# EAGLE schematic 60-amplifier-interlock (EAGLE 6.6.0)
AUTHOR: Andreas Weidner; COMPANY: Institute for Gravitational Research; DATE: 2013-03-20; DESCRIPTION: Differential output +-375V; FRMLATEXSYNTAX: 0; INFOSETTINGS: Used by 'plot.ulp' - do not edit manually! |FileTime=2015-03-18, 12:47:57|FileVersion=2||[LabelBox]|Company=Max-Planck-Institut für Gravitationsphysik|Title=HVAMPDIFF|Description=Differential output +-375V|Revision=2013-03-20|Date=2013-03-20|Author=Andreas Weidner|RevisionDate1=2015-02-04|RevisionAuthor1=Sean Leavey|RevisionDate2=2015-03-17|RevisionAuthor2=Sean Leavey|RevisionDate3=|RevisionAuthor3=|RevisionDate4=|RevisionAuthor4=|RevisionDate5=|RevisionAuthor5=||[FrontMatter]|DocTitle=Differential output HV amplifier|SubTitle=Circuit Board Documentation|Authors=Andreas Weidner and Sean Leavey|Keywords=|Abstract={This circuit provides a high-voltage amplifier with the following features:\n\\begin{compactitem}[\\enspace\\textbullet]\n\\item One output with positive gain, the other with negative gain,\n resulting in a differential output voltage of up to 750\\,V\n\\item Full-power bandwidth 400\\,kHz standard, higher with careful component trimming and peaking\n\\item Differential inputs with gain of 20 (single-sided output, differential\n output gain 40) and a selectable impedance of either >\\,1\\,k$\\Omega$\n or 50\\,$\\Omega$\n\\item Soft start of high-voltage sink to prevent power supply from locking during start-up\n\\item Over-temperature protection of output amplifier heatsink\n\\item Over-pressure protection using external pressure signal\n\\end{compactitem}}|LaTeXSyntax=1||[Safety]|VoltageHazard=1|HeatHazard=1|Convection=1|ForcedAir=0|WaterCooling=0|LightHazard=0|LaserPower=1000|LaserWavelength=1064|LaserClass=6|LightPower=1000|LightInvisible=0||[Notes]|Machinery=0|IntendedUsers=0|DisplayHints=1|; PLOTSETTINGS: Used by 'plot.ulp' - do not edit manually! |FileTime=2015-03-18, 12:47:57|FileVersion=2||[Board]|CreateBoard=0|PadDisplay=0|CreateDrillPlan=1|SiebMeyerFormat=0|IsiDrillFormat=1|CreateSolderStop=1|CreateCreamMask=0|CreateLegend=1|DisplayDimension=0|DisplayReference=1|CompensateSkew=1||[Documentation]|CreateDocumentation=1|CreateSheetDocs=1|DisplayNames=1|DisplayValues=1|DisplaySimulate=0|CreatePartList=1|CreateBoardDocs=1|CreatePlaceplan=1|DisplayJumper=1|CreateWiring=0|DisplayVias=1|CreateDrillMap=1|Create800uMap=0|CreatePreview=0|CreateValueList=1|CreateNetList=0|CreateLaTeX=1||[Variants]|HighlightUndefines=0|HighlightVariants=1|ShowVariantLists=1||[BoardSetup]|ProcessPolygons=0|PageSize=0|PageOrientation=0|MarginLeft=5|MarginTop=5|MarginRight=5|MarginBottom=5|DrillRackMM=0||[DocumentationSetup]|BlackWhite=0|FigureWidth=168|FigureHeight=237|ShrinkFigure=1|ExpandFigure=0|FigureRotate=1|TextWidth=72|ValueLibrary=1|PalatinoFont=1|LuximonoFont=1|IgnoreWidth=1||[MiscSetup]|OutlinePrecision=0.5|OutlineDiameter=2|; REVISION: 2013-03-20; REVISIONAUTHOR1: Sean Leavey; REVISIONAUTHOR2: Sean Leavey; REVISIONDATE1: 2015-02-04; REVISIONDATE2: 2015-03-17; TITLE: ERC SPEEDMETER; TITLE2: DIFF HV AMP; VARIANTSETTINGS: Used by 'variants.ulp' - do not edit manually! |FileTime=2013-05-23, 16:49:02|FileVersion=1||Title0=0-400V|Description0=|

## Sheet 1 of 3
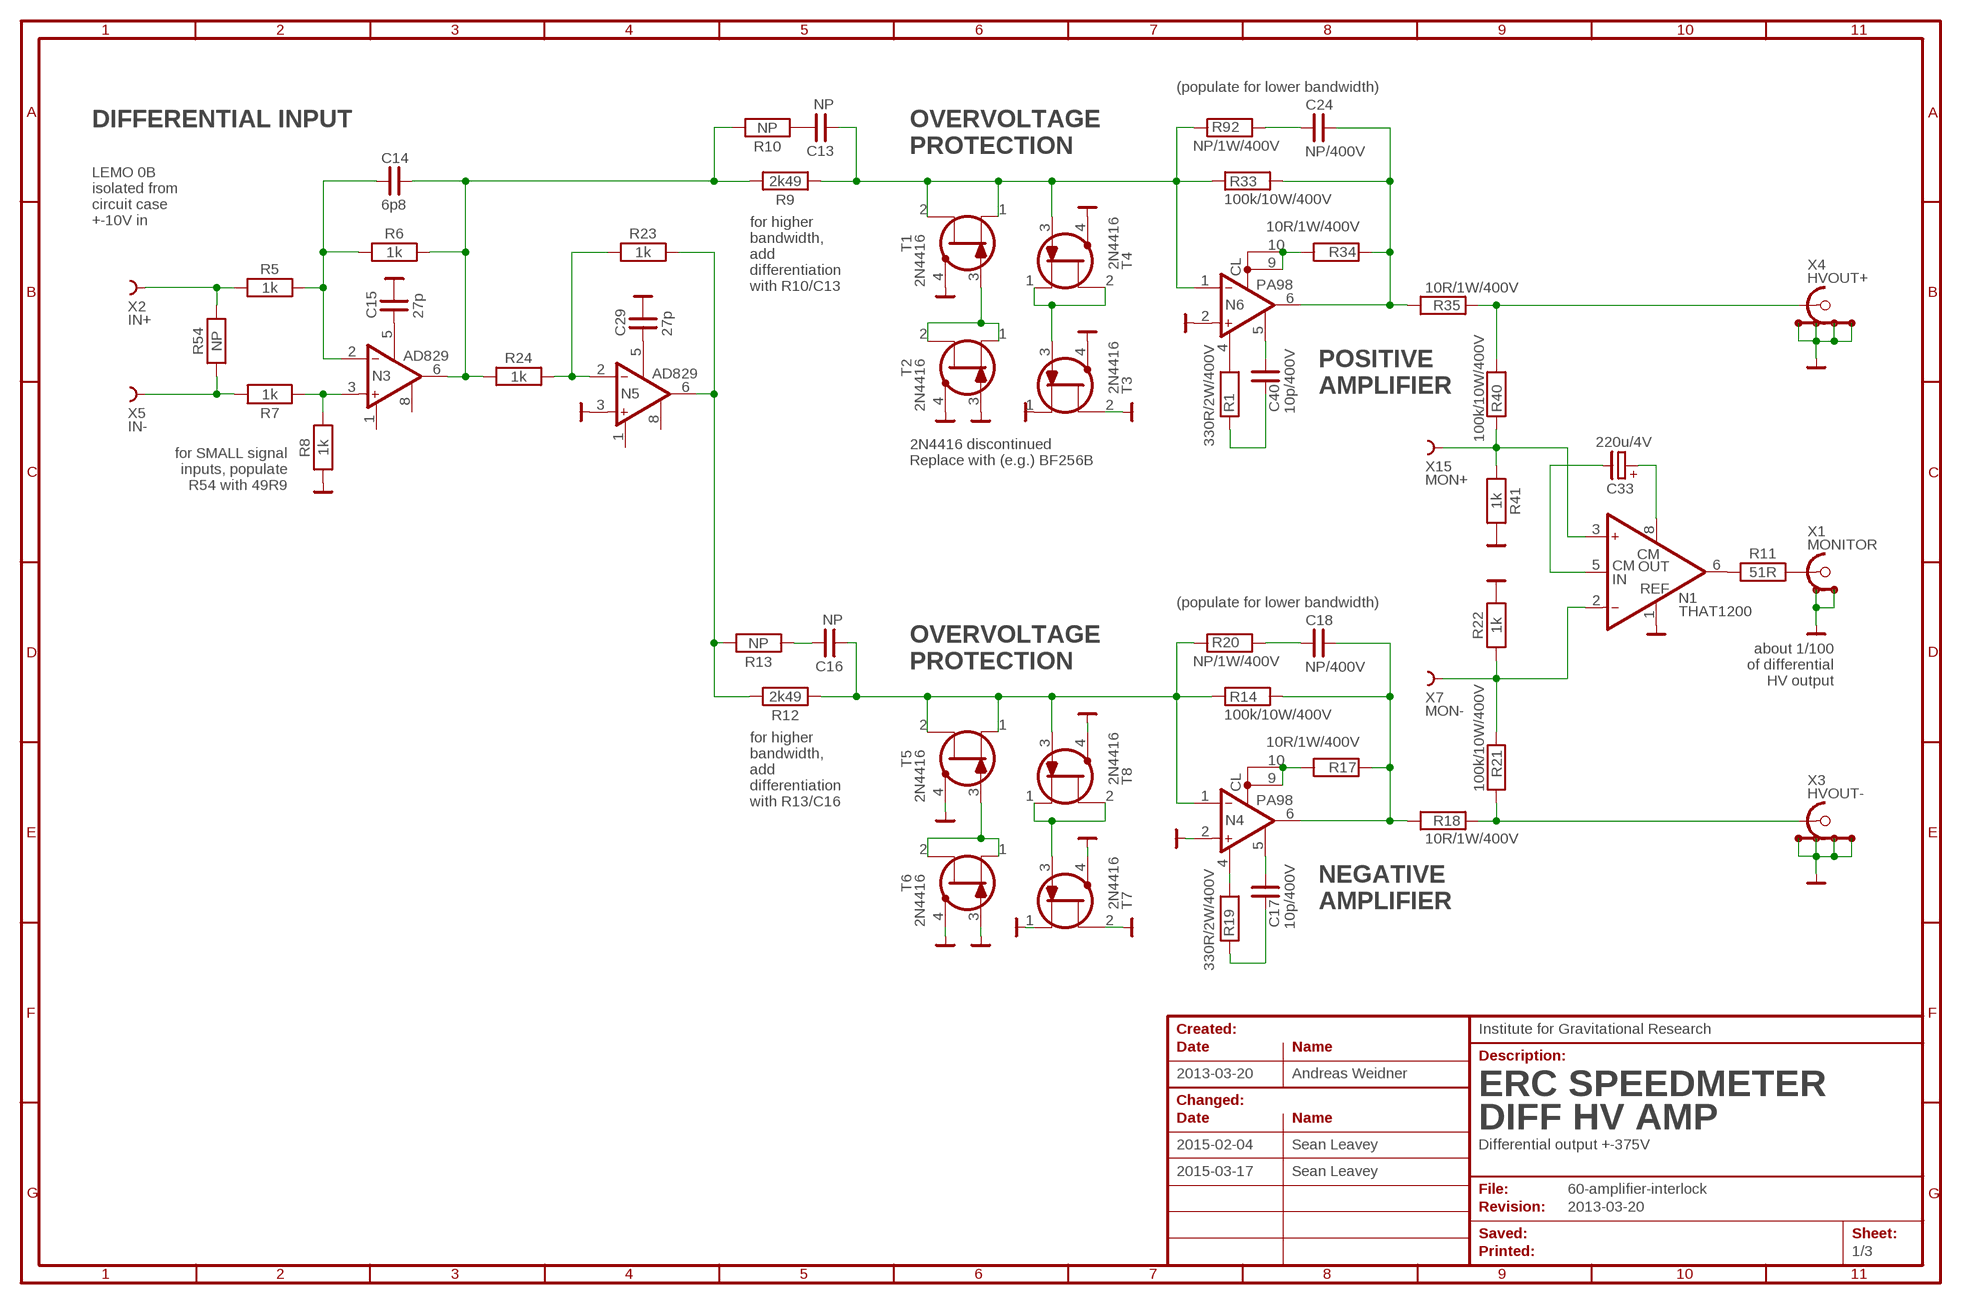
[diagram p0: schematic, sheet 1]
$47 (FRAME-A4-LANDSCAPE): SPICE: <ignore>

### Parts
C13  NP  C01N  [C01N]
C14  6p8  C0805  [C0805]
C15  27p  C0805  [C0805]
C16  NP  C01N  [C01N]
C17  10p/400V  C03R  [C03R]
C18  NP/400V  C03R  [C03R]
C24  NP/400V  C03R  [C03R]
C29  27p  C0805  [C0805]
C33  220u/4V  CEC  [CEC]
C40  10p/400V  C03R  [C03R]
N1  THAT1200  [DIP08L]
N3  AD829  [DIP08L]
N4  PA98V  [SIP03V]
N5  AD829  [DIP08L]
N6  PA98V  [SIP03V]
R1  330R/2W/400V  R04R  [R04R]
R5  1k  R1206  [R1206]
R6  1k  R1206  [R1206]
R7  1k  R1206  [R1206]
R8  1k  R1206  [R1206]
R9  2k49  R04R  [R04R]
R10  NP  R04  [R04N]
R11  51R  R1206  [R1206]
R12  2k49  R04R  [R04R]
R13  NP  R04  [R04N]
R14  100k/10W/400V  R02A  [TO220-2A]
R17  10R/1W/400V  R04R  [R04R]
R18  10R/1W/400V  R04N  [R04N]
R19  330R/2W/400V  R04R  [R04R]
R20  NP/1W/400V  R04R  [R04R]
R21  100k/10W/400V  R02A  [TO220-2A]
R22  1k  R1206  [R1206]
R23  1k  R1206  [R1206]
R24  1k  R1206  [R1206]
R33  100k/10W/400V  R02A  [TO220-2A]
R34  10R/1W/400V  R04R  [R04R]
R35  10R/1W/400V  R04N  [R04N]
R40  100k/10W/400V  R02A  [TO220-2A]
R41  1k  R1206  [R1206]
R54  NP  R1206  [R1206]
R92  NP/1W/400V  R04R  [R04R]
T1  2N4416  [TO72N]
T2  2N4416  [TO72N]
T3  2N4416  [TO72N]
T4  2N4416  [TO72N]
T5  2N4416  [TO72N]
T6  2N4416  [TO72N]
T7  2N4416  [TO72N]
T8  2N4416  [TO72N]
X1  MONITOR  XS01-2S-RG174  [XS01-2S-RG174]
X2  IN+  XP-0.8CERAM-N  [XT-0.8CERAM-N]
X3  HVOUT-  XS01-4S-RG58  [XS01-4S-RG58]
X4  HVOUT+  XS01-4S-RG58  [XS01-4S-RG58]
X5  IN-  XP-0.8CERAM-N  [XT-0.8CERAM-N]
X7  MON-  XP-0.8CERAM-N  [XT-0.8CERAM-N]
X15  MON+  XP-0.8CERAM-N  [XT-0.8CERAM-N]

### Nets
GND: C15.2 C29.2 N1.1(A:REF) N4.2(A:IN+) N5.3(A:IN+) N6.2(A:IN+) R8.1 R22.2 R41.2 T1.4(CASE) T2.3(G) T2.4(CASE) T3.1(S) T3.2(D) T3.4(CASE) T4.4(CASE) T5.4(CASE) T6.3(G) T6.4(CASE) T7.1(S) T7.2(D) T7.4(CASE) T8.4(CASE) X1.GND@1(GND) X1.GND@2(GND) X3.GND@1(GND) X3.GND@2(GND) X3.GND@3(GND) X3.GND@4(GND) X4.GND@1(GND) X4.GND@2(GND) X4.GND@3(GND) X4.GND@4(GND) ; supply symbol labelled VG ; also sheet 2,3
HVOUT+ [HV]: R35.2 R40.1 X4.SIG
HVOUT- [HV]: R18.2 R21.1 X3.SIG
MON+: N1.3(A:IN+) R40.2 R41.1 X15.MP
MON-: N1.2(A:IN-) R21.2 R22.1 X7.MP
N$3: R11.2 X1.SIG
N$6: N1.6(A:OUT) R11.1
N$9: C16.2 R13.1
N$11: T7.3(G) T8.1(S) T8.2(D)
N$13: T5.3(G) T6.1(S) T6.2(D)
N$14 [HV]: N4.9(A:CL) N4.10(A:CL) R17.1
N$15: R5.1 R54.2 X2.MP
N$16: R7.1 R54.1 X5.MP
N$17: C14.1 N3.2(A:IN-) R5.2 R6.1
N$18: C15.1 N3.5(A:OPF)
N$19: C14.2 N3.6(A:OUT) R6.2 R9.2 R10.2 R24.1
N$20: N3.3(A:IN+) R7.2 R8.2
N$21 [HV]: C18.2 N4.6(A:OUT) R14.1 R17.2 R18.1
N$23 [HV]: N4.4(A:OPC1) R19.2
N$24 [HV]: C17.1 N4.5(A:OPC2)
N$25 [HV]: C17.2 R19.1
N$26: C16.1 N4.1(A:IN-) R12.1 R14.2 R20.1 T5.1(S) T5.2(D) T8.3(G)
N$27 [HV]: C18.1 R20.2
N$29: C29.1 N5.5(A:OPF)
N$30: N5.2(A:IN-) R23.1 R24.2
N$31: N5.6(A:OUT) R12.2 R13.2 R23.2
N$32: C33.+ N1.8(A:CMOUT)
N$33: C33.- N1.5(A:CMIN)
N$39: C13.2 R10.1
N$49 [HV]: N6.9(A:CL) N6.10(A:CL) R34.1
N$52 [HV]: C24.2 N6.6(A:OUT) R33.1 R34.2 R35.1
N$60: T3.3(G) T4.1(S) T4.2(D)
N$61: T1.3(G) T2.1(S) T2.2(D)
N$68 [HV]: N6.4(A:OPC1) R1.2
N$69 [HV]: C40.1 N6.5(A:OPC2)
N$70 [HV]: C40.2 R1.1
N$71: C13.1 N6.1(A:IN-) R9.1 R33.2 R92.1 T1.1(S) T1.2(D) T4.3(G)
N$146 [HV]: C24.1 R92.2
Unconnected: N3.1(A:OPC1) N3.8(A:OPC2) N5.1(A:OPC1) N5.8(A:OPC2)

### Notes on the sheet
- (populate for lower bandwidth)
- DIFFERENTIAL INPUT | OVERVOLTAGE
- PROTECTION
- for higher
  bandwidth,
  add
  differentiation
  with R10/C13
- LEMO 0B
  isolated from
  circuit case
  +-10V in
- POSITIVE
  AMPLIFIER
- for SMALL signal
  inputs, populate
  R54 with 49R9
- 2N4416 discontinued
  Replace with (e.g.) BF256B
- (populate for lower bandwidth)
- OVERVOLTAGE
- about 1/100
  of differential
  HV output
- PROTECTION
- for higher
  bandwidth,
  add
  differentiation
  with R13/C16
- NEGATIVE
  AMPLIFIER

## Sheet 2 of 3
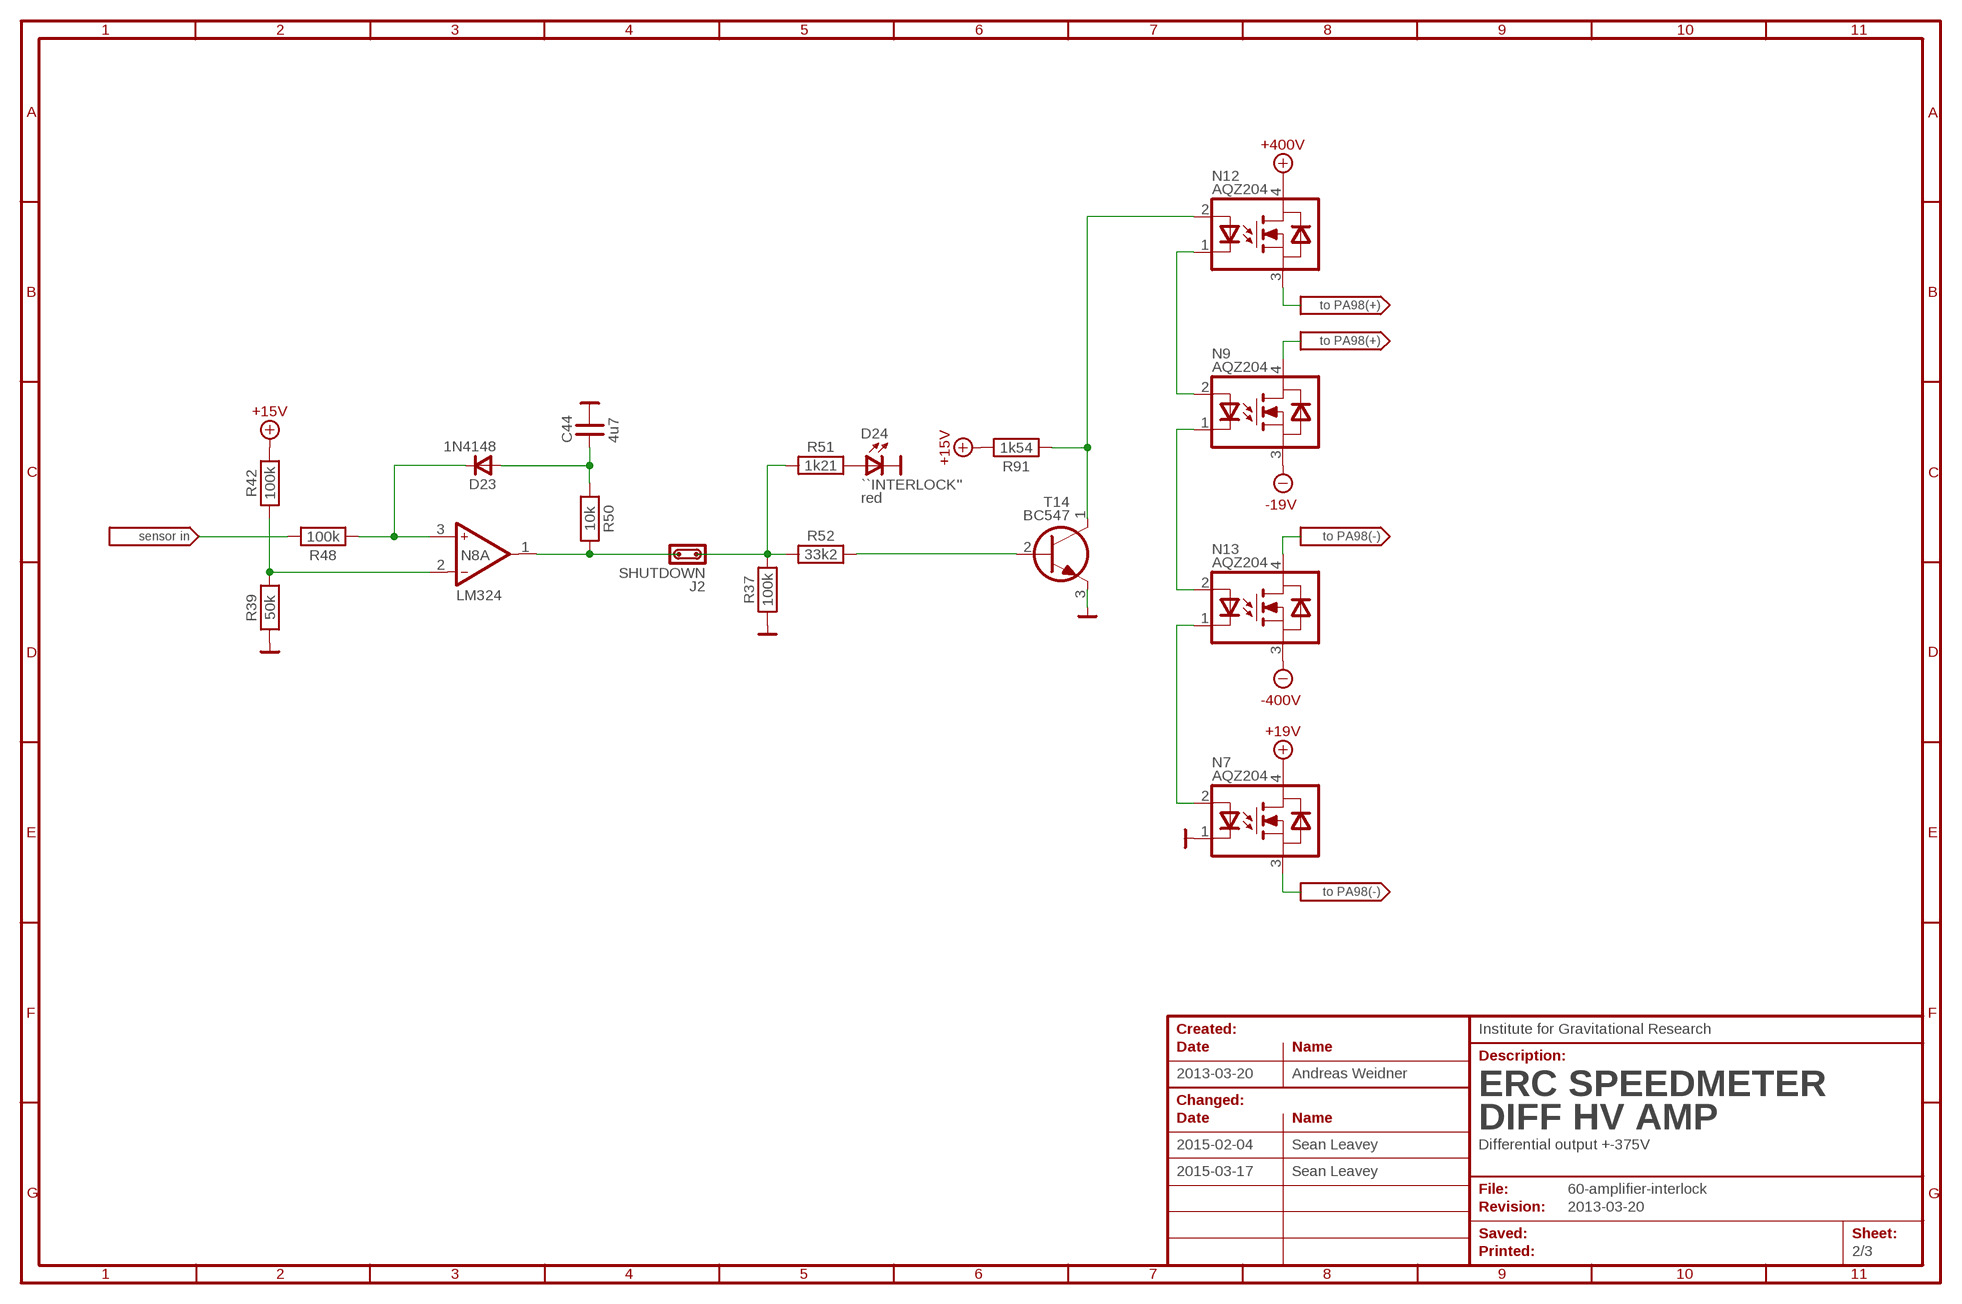
[diagram p1: schematic, sheet 2]
$6 (VS): SPICE: <ignore>
$14 (VS): SPICE: <ignore>
$15 (VS): SPICE: <ignore>
$45 (FRAME-A4-LANDSCAPE): SPICE: <ignore>
$83 (VS): SPICE: <ignore>
$84 (VS): SPICE: <ignore>

### Parts
C44  4u7  C02-MKS2-7.0-R  [C02-MKS2-7.0-R]
D23  1N4148  1N4148-04R  [D04R-DO35-TYPE]
D24  ``INTERLOCK''  DL-CABLE-CODED-L  [DL-CABLE-CODED-L]
J2  SHUTDOWN  JP02R  [JP02R]
N7  AQZ204  AQZ104R  [AQZ-R]
N8  LM324  [DIP14L]
N9  AQZ204  AQZ104R  [AQZ-R]
N12  AQZ204  AQZ104R  [AQZ-R]
N13  AQZ204  AQZ104R  [AQZ-R]
R37  100k  R04R  [R04R]
R39  50k  R  [R04N]
R42  100k  R  [R04N]
R48  100k  R  [R04N]
R50  10k  R  [R04N]
R51  1k21  R04R  [R04R]
R52  33k2  R04R  [R04R]
R91  1k54  R04R  [R04R]
T14  BC547DR  [TO92DR]

### Nets
+15V: R42.2 R91.2 ; supply symbol labelled V+15V ; also sheet 3
+19V: N7.4(+) ; supply symbol labelled V+19V ; also sheet 3
+400V [HV]: N12.4(+) ; supply symbol labelled V+400V ; also sheet 3
-19V: N9.3(-) ; supply symbol labelled V-19V ; also sheet 3
-400V [HV]: N13.3(-) ; supply symbol labelled V-400V ; also sheet 3
GND: C44.2 D24.C N7.1(C) R37.1 R39.1 T14.3(E) ; supply symbol labelled VG ; also sheet 1,3
N$1: N7.3(-)
N$4: N9.4(+)
N$41: R48.2
N$43: N9.2(A) N12.1(C)
N$45: N7.2(A) N13.1(C)
N$46: C44.1 D23.A R50.1
N$50: N8.2(A:IN-) R39.2 R42.1
N$51: J2.1 R37.2 R51.1 R52.1
N$53: J2.2 N8.1(A:OUT) R50.2
N$54: D24.A R51.2
N$55: R52.2 T14.2(B)
N$57: D23.C N8.3(A:IN+) R48.1
N$59: N12.2(A) R91.1 T14.1(C)
N$96 [HV]: N13.4(+)
N$125 [HV]: N12.3(-)
N$127: N9.1(C) N13.2(A)
Unconnected: N8.5(B:IN+) N8.6(B:IN-) N8.7(B:OUT) N8.8(C:OUT) N8.9(C:IN-) N8.10(C:IN+) N8.12(D:IN+) N8.13(D:IN-) N8.14(D:OUT)

## Sheet 3 of 3
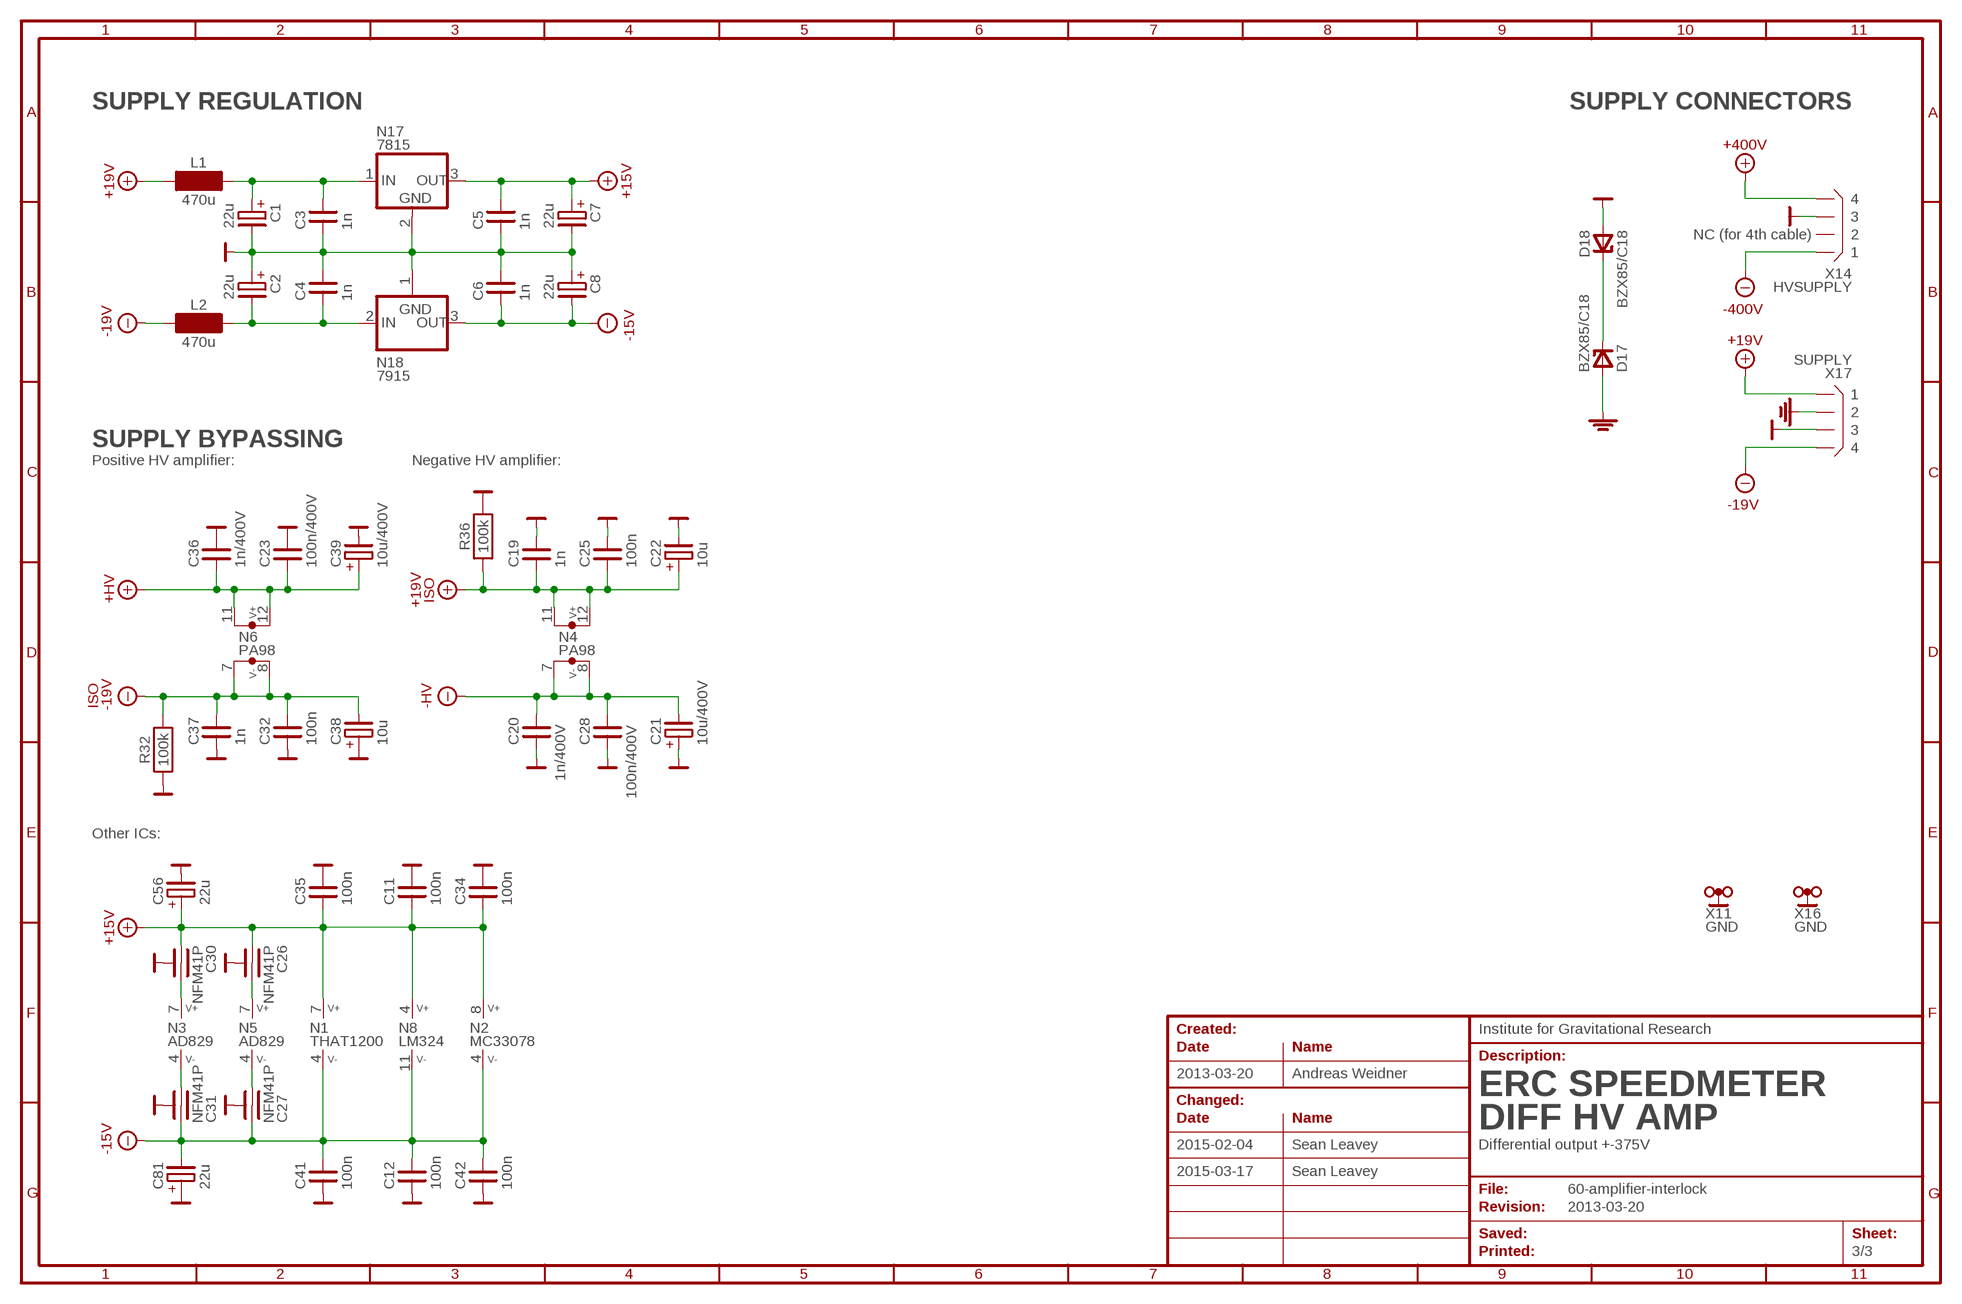
[diagram p2: schematic, sheet 3]
$46 (FRAME-A4-LANDSCAPE): SPICE: <ignore>

### Parts
C1  22u  CE02-TANTAL-7.5-N  [CE02-TANTAL-7.5-N]
C2  22u  CE02-TANTAL-7.5-N  [CE02-TANTAL-7.5-N]
C3  1n  C01N  [C01N]
C4  1n  C01N  [C01N]
C5  1n  C01N  [C01N]
C6  1n  C01N  [C01N]
C7  22u  CE02-TANTAL-7.5-N  [CE02-TANTAL-7.5-N]
C8  22u  CE02-TANTAL-7.5-N  [CE02-TANTAL-7.5-N]
C11  100n  C01R  [C01R]
C12  100n  C01R  [C01R]
C19  1n  C0805  [C0805]
C20  1n/400V  C1206  [C1206]
C21  10u/400V  CE02A  [CE02A]
C22  10u  CE01-TANTAL-5.0-N  [CE01-TANTAL-5.0-N]
C23  100n/400V  C1812  [C1812]
C25  100n  C0805  [C0805]
C26  NFM41P  CF  [CF-NFM41P]
C27  NFM41P  CF  [CF-NFM41P]
C28  100n/400V  C1812  [C1812]
C30  NFM41P  CF  [CF-NFM41P]
C31  NFM41P  CF  [CF-NFM41P]
C32  100n  C0805  [C0805]
C34  100n  C01R  [C01R]
C35  100n  C01-CERAMIC-R  [C01-CERAMIC-R]
C36  1n/400V  C1206  [C1206]
C37  1n  C0805  [C0805]
C38  10u  CE01-TANTAL-5.0-N  [CE01-TANTAL-5.0-N]
C39  10u/400V  CE02A  [CE02A]
C41  100n  C01-CERAMIC-R  [C01-CERAMIC-R]
C42  100n  C01R  [C01R]
C56  22u  CE02-TANTAL-7.5-N  [CE02-TANTAL-7.5-N]
C81  22u  CE02-TANTAL-7.5-N  [CE02-TANTAL-7.5-N]
D17  BZX85/C18  DZ04B  [DZ04B]
D18  BZX85/C18  DZ04B  [DZ04B]
L1  470u  LA  [LA]
L2  470u  LA  [LA]
N2  MC33078  [DIP08L]
N17  7815  [TO220N]
N18  7915  [TO220N]
R32  100k  R  [R04N]
R36  100k  R  [R04N]
X11  XG  [XG02N]
X14  HVSUPPLY  X04-SCREW  [X04-SCREW]
X16  XG  [XG02N]
X17  SUPPLY  X04-SCREW  [X04-SCREW]

### Nets
+15V: C5.2 C7.+ C11.1 C26.1 C30.1 C34.1 C35.1 C56.+ N1.7(P:V+) N2.8(P:V+) N8.4(P:V+) N17.3(OUT) ; supply symbol labelled V+15V ; also sheet 2
+19V: L1.1 X17.1 ; supply symbol labelled V+19V ; also sheet 2
+19VISO: C19.1 C22.+ C25.1 N4.11(P:V+) N4.12(P:V+) R36.1 ; supply symbol labelled V+19V-ISO
+400V [HV]: X14.4 ; supply symbol labelled V+400V ; also sheet 2
+HV [HV]: C23.1 C36.1 C39.+ N6.11(P:V+) N6.12(P:V+) ; supply symbol labelled V+HV
-15V: C6.1 C8.- C12.2 C27.1 C31.1 C41.2 C42.2 C81.- N1.4(P:V-) N2.4(P:V-) N8.11(P:V-) N18.3(OUT) ; supply symbol labelled V-15V
-19V: L2.1 X17.4 ; supply symbol labelled V-19V ; also sheet 2
-19VISO: C32.2 C37.2 C38.- N6.7(P:V-) N6.8(P:V-) R32.2 ; supply symbol labelled V-19V-ISO
-400V [HV]: X14.1 ; supply symbol labelled V-400V ; also sheet 2
-HV [HV]: C20.2 C21.- C28.2 N4.7(P:V-) N4.8(P:V-) ; supply symbol labelled V-HV
GND: C1.- C2.+ C3.1 C4.2 C5.1 C6.2 C7.- C8.+ C11.2 C12.1 C19.2 C20.1 C21.+ C22.- C23.2 C25.2 C26.GND C27.GND C28.1 C30.GND C31.GND C32.1 C34.2 C35.2 C36.2 C37.1 C38.+ C39.- C41.1 C42.1 C56.- C81.+ D18.A N17.2(GND) N18.1(GND) R32.1 R36.2 X14.3 X17.3 ; supply symbol labelled VG ; also sheet 1,2
N$2: C1.+ C3.2 L1.2 N17.1(IN)
N$5: C2.- C4.1 L2.2 N18.2(IN)
N$7: C27.2 N5.4(P:V-)
N$28: C26.2 N5.7(P:V+)
N$80: C31.2 N3.4(P:V-)
N$81: C30.2 N3.7(P:V+)
N$93: D17.C D18.C
PE: D17.A X17.2 ; supply symbol labelled VPE
Unconnected: N2.1(A:OUT) N2.2(A:IN-) N2.3(A:IN+) N2.5(B:IN+) N2.6(B:IN-) N2.7(B:OUT) X14.2

### Notes on the sheet
- SUPPLY REGULATION | SUPPLY CONNECTORS
- NC (for 4th cable)
- SUPPLY BYPASSING
- Positive HV amplifier: | Negative HV amplifier:
- Other ICs:

## Power pins joined to a net without a drawn wire
GND: X11.MP1(GND) X11.MP2(GND) X16.MP1(GND) X16.MP2(GND)

## Library data of the parts
C1 C2 C7 C8 C21 C22 C33 C38 C39 C56 C81 = miscs:CE: Electrolytic capacitor, unipolar _____ SPICE implementation as a bipolar capacitor with the supported attributes: VALUE, VOLTAGE, CPARALLEL, LSERIES, RLSHUNT, RPARALLEL, RSERIES (A detailed description of these parameters can be found in the library spice.lbr); SPICE: <IDEALMODEL>\n<name:C> <pin:A.+> <pin:A.-> <autovalue><voltage: ic=>\n\n<REALMODEL>\n<name:C> <pin:A.+> <pin:A.-> <autovalue><voltage: ic=><rseries: rser=><lseries: lser=><rparallel: rpar=><cparallel: cpar=><rlshunt: rlshunt=>
C3-C6 C11-C20 C23-C25 C28 C29 C32 C34-C37 C40-C42 C44 = miscs:C: Capacitor, bipolar _____ Supported SPICE attributes: VALUE, VOLTAGE, CPARALLEL, LSERIES, RLSHUNT, RPARALLEL, RSERIES (A detailed description of these parameters can be found in the library spice.lbr) _____ References (PDF files, electronics workshop server): WIMA FKP 02 <http://elektronik.aei.uni-hannover.de:3000/datasheets/capacitors/wima-fkp02.pdf> (polypropylene film capacitors, 0.1" spacing) WIMA FKP 2 <http://elektronik.aei.uni-hannover.de:3000/datasheets/capacitors/wima-fkp2.pdf> (polypropylene film capacitors, 0.2" spacing) WIMA FKS 2 <http://elektronik.aei.uni-hannover.de:3000/datasheets/capacitors/wima-fks2.pdf> (polyester film capacitors, 0.2" spacing) WIMA MKP 2 <http://elektronik.aei.uni-hannover.de:3000/datasheets/capacitors/wima-mkp2.pdf> (polypropylene film capacitors, 0.2" spacing) WIMA MKS 02 <http://elektronik.aei.uni-hannover.de:3000/datasheets/capacitors/wima-mks02.pdf> (polyester film capacitors, 0.1" spacing) WIMA MKS 2 <http://elektronik.aei.uni-hannover.de:3000/datasheets/capacitors/wima-mks2.pdf> (polyester film capacitors, 0.2" spacing) Kemet ceramics <http://elektronik.aei.uni-hannover.de:3000/datasheets/capacitors/kemet-ceramics.pdf> (multilayer ceramic leaded capacitors) Vishay ceramics HV <http://elektronik.aei.uni-hannover.de:3000/datasheets/capacitors/vishay-ceramic-hv.pdf> (multilayer ceramic leaded capacitors, high voltage) LCR EXFS/HR polystyrene <http://elektronik.aei.uni-hannover.de:3000/datasheets/capacitors/exfshr-polystyrene.pdf> (polystyrene radial capacitors, 0.2" spacing) LCR FSC polystyrene <http://elektronik.aei.uni-hannover.de:3000/datasheets/capacitors/fsc-polystyrene.pdf> (polystyrene axial capacitors, round); SPICE: <IDEALMODEL>\n<name:C> <pin:A.1> <pin:A.2> <autovalue><voltage: ic=>\n\n<REALMODEL>\n<name:C> <pin:A.1> <pin:A.2> <autovalue><voltage: ic=><rseries: rser=><lseries: lser=><rparallel: rpar=><cparallel: cpar=><rlshunt: rlshunt=>
C26 C27 C30 C31 = miscs:CF: Feedthrough capacitor bipolar _____ SPICE implementation as a bipolar capacitor in the center of two 50µΩ resistors, supporting the attributes: VALUE, VOLTAGE (A detailed description of these parameters can be found in the library spice.lbr); SPICE: <name:R>.left <pin:A.1> <name>.C 50u\n<name:R>.right <name>.C <pin:A.2> 50u\n<name:C> <name>.C <pin:A.GND> <autovalue><voltage: ic=>
D17 D18 = diodes:DZ: Zener diode; VALUE: DZ
D23 = diodes:1N4148: 1N4148/LL4148/1N4448/LL4448: General purpose silicon diode 100V, 200mA, 500mW, 1V @ 10mA Wired packages: 1N4148/1N4448, MiniMELF package: LL4148/LL4448 _____ Supported SPICE subcircuits: 1N4148-SUB Supported SPICE attributes: TEMPERATURE; SPICE: <name:X> <pin:A.A> <pin:A.C> <subckt:1N4148-SUB><temperature: devicetemp=>; TYPE: 1N4148
D24 = optos:DL: LED _____ The LED colour can be changed with the attribute COLOR.; COLOR: red; IGNOREVALUE: 1
J2 = connectors:JP02: Jumper 2 pins; IGNOREVALUE: 1; SPICE: <ignore>
L1 L2 = miscs:L: Coil, European symbol _____ Supported SPICE attributes: VALUE, CURRENT, CPARALLEL, RPARALLEL, RSERIES (A detailed description of these parameters can be found in the library spice.lbr)
N1 = opamps:THAT1200: THAT1200: Balanced line receiver (THAT corporation) Gain=1, ±15V, ±25mA, 1.4nA bias 300nA offset current, 12MHz UGF, 27nV/rt(Hz) noise _____ References: - PDF datasheet <http://elektronik.aei.uni-hannover.de:3000/datasheets/opamps/instrumentation/that1200.pdf> (electronics workshop server) - Manufacturer's link <http://www.thatcorp.com/1200-series_High_CMRR_Balanced_Line_Receiver_ICs.shtml#appnotes> (THAT Corporation website) - Internet search <http://www.google.de/search?q=that1200> (Google results) ___ Supported SPICE subcircuits: 1200_THAT; SPICE: <gate:A>\n <part:X> <pin:A.IN+> <pin:A.IN-> <pin:P.V+> <pin:P.V-> <pin:A.OUT> <pin:A.REF> <pin:A.CMIN> <pin:A.CMOUT> <subckt:1200_THAT>\n<gate:P>\n <ignore>; TYPE: THAT1200
N2 = opamps:MC33078: MC33078: Dual low noise opamp (ST Microelectronics) ±15V, ±15mA, 750nA bias 2mV offset, 10MHz UGF, 4.5nV/rt(Hz) noise _____ References: - PDF datasheet <http://elektronik.aei.uni-hannover.de:3000/datasheets/opamps/opamps/mc33078.pdf> (electronics workshop server) - Manufacturer's link <http://www.st.com/web/catalog/sense_power/FM123/SC61/SS1614/PF64026?s_searchtype=partnumber> (ST Microelectronics website) - Internet search <http://www.google.de/search?q=mc33078> (Google results); TYPE: MC33078
N3 N5 = opamps:AD829: AD829: High speed video opamp (Analog Devices) ±15V, ±32mA, 9µA bias 1mV offset, 600MHz UGF, 2nV/rt(Hz) noise _____ References: - PDF datasheet <http://elektronik.aei.uni-hannover.de:3000/datasheets/opamps/opamps/ad829.pdf> (electronics workshop server) - Manufacturer's link <http://www.analog.com/en/all-operational-amplifiers-op-amps/operational-amplifiers-op-amps/ad829/products/product.html> (Analog Devices website) - Internet search <http://www.google.de/search?q=ad829> (Google results) _____ Supported SPICE subcircuit: AD829 Supported LISO model: AD829; LISO: <gate:A>\n op <part> <type> <pin:A.IN+> <pin:A.IN-> <pin:A.OUT>\n <warning:Compensation and power supply of <part> not included in simulation>\n\n<gate:P>\n <ignore>; SPICE: <gate:A>\n <name:X> <pin:A.IN+> <pin:A.IN-> <pin:P.V+> <pin:P.V-> <pin:A.OUT> <pin:A.OPF> <subckt:AD829>\n\n<gate:P>\n <ignore>; TYPE: AD829
N4 N6 = opamps:PA98: PA98: High voltage power opamp (Apex) ±225V, ±200mA, 100pA bias 2mV offset, 100MHz UGF, 4nV/rt(Hz) noise _____ References: - PDF datasheet <http://elektronik.aei.uni-hannover.de:3000/datasheets/opamps/opamps/pa98.pdf> (electronics workshop server) - Manufacturer's link <http://www.cirrus.com/en/products/pa98.html?prodKey=pa98> (Cirrus Logic website) - Internet search <http://www.google.de/search?q=pa98> (Google results) _____ Supported SPICE subcircuit: PA98; SPICE: <gate:A>\n <name:X> <pin:A.IN+> <pin:A.IN-> <pin:A.CL@1> <pin:A.OUT> <pin:P.V+@1> <pin:P.V-@1> <pin:A.OPC1> <pin:A.OPC2> <subckt:PA98>\n\n<gate:P>\n <ignore>; TYPE: PA98; VALUE: PA98
N7 N9 N12 N13 = optos:AQZ10*
N8 = opamps:LM324: LM324: Quad opamp (National Semiconductor) ±15V, ±40mA, 500nA bias 9mV offset, 500kHz UGF ___ References: - PDF datasheet <http://elektronik.aei.uni-hannover.de:3000/datasheets/opamps/opamps/lm324.pdf> (electronics workshop server) - Manufacturer's link <http://www.ti.com/product/lm324> (Texas Instruments website) - Internet search <http://www.google.de/search?q=lm324> (Google results) _____ Supported SPICE subcircuits: LM324; SPICE: <gate:A>\n <name:X> <pin:A.IN+> <pin:A.IN-> <pin:P.V+> <pin:P.V-> <pin:A.OUT> <subckt:LM324>\n\n<gate:B>\n <name:X> <pin:B.IN+> <pin:B.IN-> <pin:P.V+> <pin:P.V-> <pin:B.OUT> <subckt:LM324>\n\n<gate:C>\n <name:X> <pin:C.IN+> <pin:C.IN-> <pin:P.V+> <pin:P.V-> <pin:C.OUT> <subckt:LM324>\n\n<gate:D>\n <name:X> <pin:D.IN+> <pin:D.IN-> <pin:P.V+> <pin:P.V-> <pin:D.OUT> <subckt:LM324>\n\n<gate:P>\n <ignore>; TYPE: LM324
N17 = ics:78*: 78xx: Fixed positive voltage regulator Voltage can be selected with change technology; TYPE: 7815
N18 = ics:79*: 79xx: Fixed negative voltage regulator Voltage can be selected with change technology; TYPE: 7915
R1 R5-R14 R17-R24 R32-R37 R39-R42 R48 R50-R52 R54 R91 R92 = miscs:R: Resistor, European symbol _____ Supported SPICE attributes: VALUE (A detailed description of these parameters can be found in the library spice.lbr); SPICE: <name:R> <pin:A.1> <pin:A.2> <autovalue>
T1-T8 = transistors:2N4416: 2N4416: VHF N-channel JFET (Motorola, National) ±30V Uds, -6V Ugsoff _____ References: - PDF datasheet <http://elektronik.aei.uni-hannover.de:3000/datasheets/transistors/jfet/nchannel/2n4416.pdf> (electronics workshop server) - Internet search <http://www.google.de/search?q=2n4416> (Google results) _____ Obsolete - not recommended for new designs; TYPE: 2N4416
T14 = transistors:BC547: BC547: Universal NPN transistor (Motorola, Siemens) 45V Uce, 100mA Ic, 75-900 hfe Complementary type BC557 _____ Supported SPICE models: BC547C BC547B _____ References: - PDF datasheet <http://elektronik.aei.uni-hannover.de:3000/datasheets/transistors/bipolar/npn/bc547.pdf> (electronics workshop server) - Manufacturer's link <http://www.fairchildsemi.com/pf/BC/BC547.html?rd=Y> (Fairchild website) - Internet search <http://www.google.de/search?q=bc547> (Google results); SPICE: <name:Q> <pin:A.C> <pin:A.B> <pin:A.E> <model:BC547C BC547B><temperature: temp=><voltages: ic=>; TYPE: BC547; VALUE: BC547
X1 = connectors:XS01-2S: Shielded connector, 2 shield pins; IGNOREVALUE: 1; SPICE: <ignore>
X2 X5 X7 X15 = connectors:XP: Pin (input/output) _____ The colour of insulated ceramic pins can be changed with the attribute COLOR.; IGNOREVALUE: 1; SPICE: <ignore>
X3 X4 = connectors:XS01-4S: Shielded connector, 4 shield pins - LEMO 00 - SMA - Crimpterminal RG174/RG58; IGNOREVALUE: 1; SPICE: <ignore>
X11 X16 = connectors:XG: Ground test point 2 pins; IGNOREVALUE: 1; SPICE: <ignore>
X14 X17 = connectors:X04: Connector 4 pins; IGNOREVALUE: 1; SPICE: <ignore>

## Net classes
1 HV: clearance 0.762 mm